# Altium project BMD_RevB_IDL_18_014.PrjPcb (part 2 of 2)

## Sheet BMD_RevB_B6_INOUT.SchDoc: IN/OUT & MISC
size 401 x 291 mm; DocumentNumber: 2; SheetNumber: 6; SheetTotal: 6
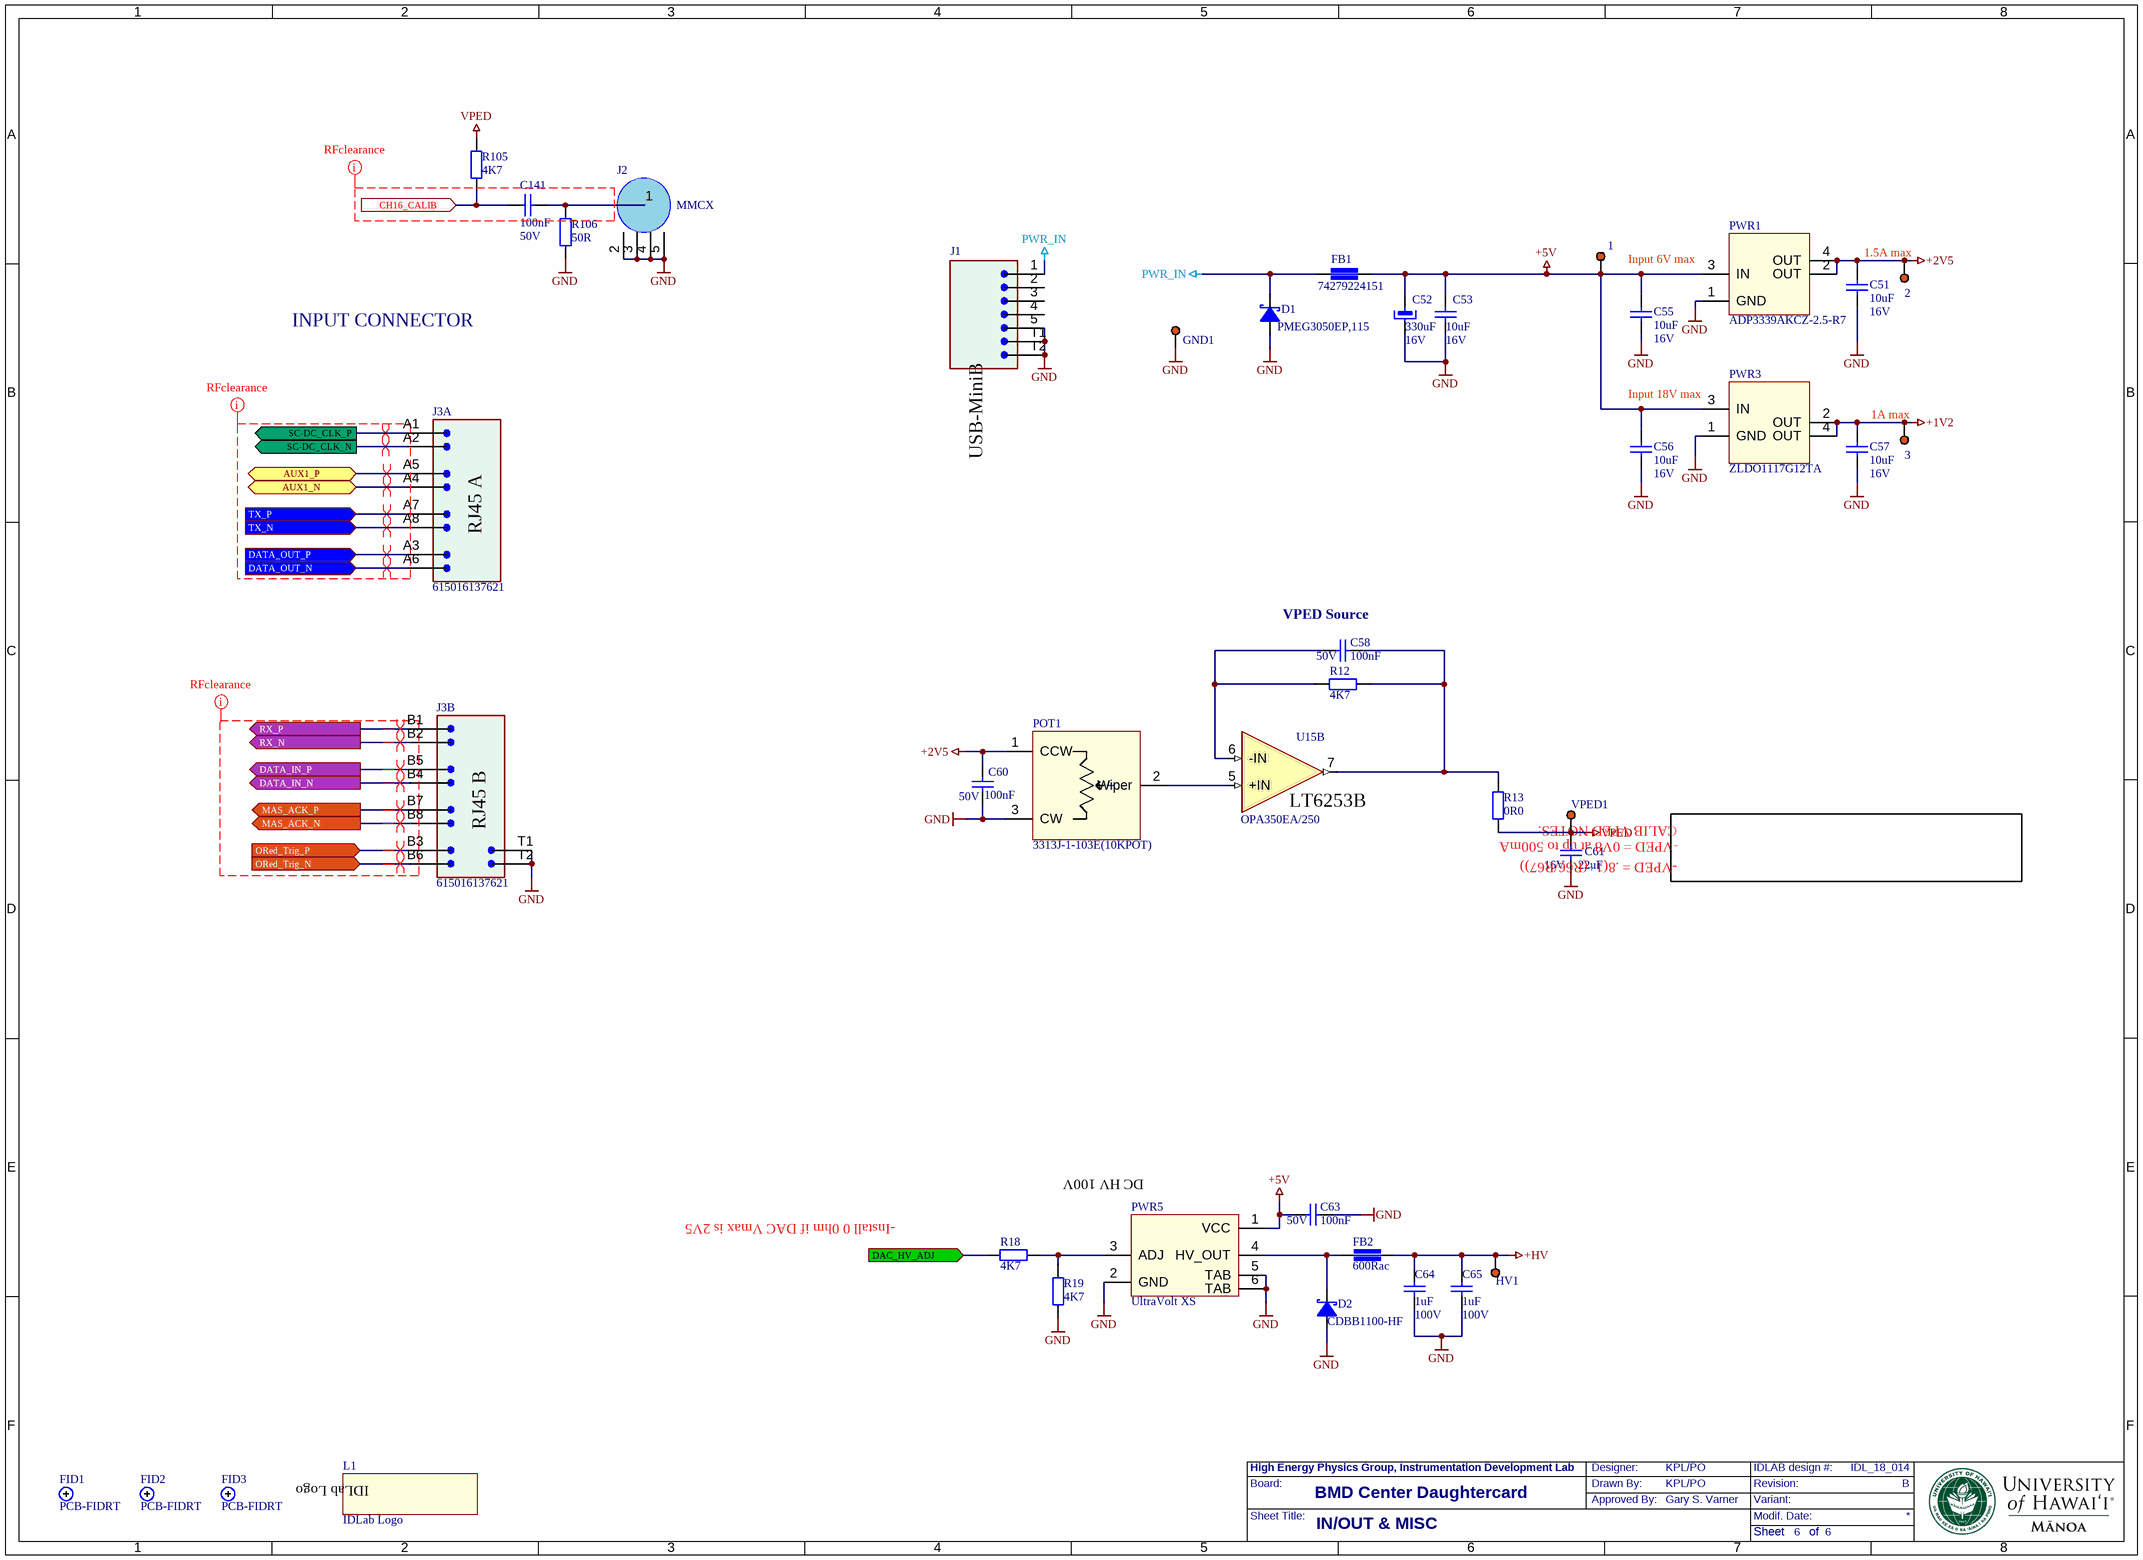
[diagram p5: BMD_RevB_B6_INOUT.SchDoc]

### Parts
(Parts that share a designator on the sheet are numbered #1, #2 ... from top to bottom, then left to right.)
1  SP1.5S  [SP1.5SQ]  (value not drawn)  (no BOM)
2  SP1.5S  [SP1.5SQ]  (value not drawn)  (no BOM)
3  SP1.5S  [SP1.5SQ]  (value not drawn)  (no BOM)
C51  10uF  Voltage rating: 16V  [CC1206N1R]
C52  330uF  Voltage rating: 16V  [CTC-D7343-43]
C53  10uF  Voltage rating: 16V  [CC1206N1R]
C55  10uF  Voltage rating: 16V  [CC1206N1R]
C56  10uF  Voltage rating: 16V  [CC1206N1R]
C57  10uF  Voltage rating: 16V  [CC1206N1R]
C58  100nF  Voltage rating: 50V  [CC0402N1R]
C60  100nF  Voltage rating: 50V  [CC0402N1R]
C61  22uF  Voltage rating: 16V  [CC0805N1R]
C63  100nF  Voltage rating: 50V  [CC0402N1R]
C64  1uF  Voltage rating: 100V  [CC1206N1R]
C65  1uF  Voltage rating: 100V  [CC1206N1R]
C141  100nF  Voltage rating: 50V  [CC0402N1R]
D1  PMEG3050EP,115  [SOD128]
D2  CDBB1100-HF  [DSMB-N]
FB1  74279224151  [FB2220N1R]
FB2  600Rac  [FB0603N1R]
FID1  PCB-FIDRT  [FIDRT50]  (net tie)
FID2  PCB-FIDRT  [FIDRT50]  (net tie)
FID3  PCB-FIDRT  [FIDRT50]  (net tie)
GND1  SP1.5S  [SP1.5SQ]  (value not drawn)  (no BOM)
HV1  SP1.5S  [SP1.5SQ]  (value not drawn)  (no BOM)
J1  0548190519  [USB_MINIB]  (value not drawn)
J2  MMCX  [MMCX_VERTICAL_THROUGH_HOLE]
J3  615016137621  [2X1 RJ45]  (parts A,B of 2)
L1  IDLab Logo  [IDLab logo]
POT1  3313J-1-103E(10KPOT)  [2KPOT]
PWR1  ADP3339AKCZ-2.5-R7  [SOT223]
PWR3  ZLDO1117G12TA  [SOT223]
PWR5  UltraVolt XS  [UltraVolt XS]
R12  4K7  [RC0402N1R]
R13  0R0  [RC0603N1R]
R18  4K7  [RC0402N1R]
R19  4K7  [RC0402N1R]
R105  4K7  [RC0402N1R]
R106  50R  [RC0402RF1]
U15#2  OPA350EA/250  [MSOP8N]  (part B of 2)
VPED1  SP1.5S  [SP1.5SQ]  (value not drawn)  (no BOM)

### Ports
AUX1_N (bidir), AUX1_P (bidir), CH16_CALIB (in), DAC_HV_ADJ (in), DATA_IN_N (out), DATA_IN_P (out), DATA_OUT_N (in), DATA_OUT_P (in), MAS_ACK_N (out), MAS_ACK_P (out), ORed_Trig_N (in), ORed_Trig_P (in), RX_N (out), RX_P (out), SC-DC_CLK_N (out), SC-DC_CLK_P (out), TX_N (in), TX_P (in)

### Nets
+1V2: 3.1 C57.2 PWR3.2(OUT) PWR3.4(OUT)
+2V5: 2.1 C51.2 C60.1 POT1.1(CCW) PWR1.2(OUT) PWR1.4(OUT)
+5V: 1.1 C52.1 C53.2 C55.2 C56.2 C63.2 FB1.2 PWR1.3(IN) PWR3.3(IN) PWR5.1(VCC)
+HV: C64.2 C65.2 FB2.2 HV1.1
GND: C51.1 C52.2 C53.1 C55.1 C56.1 C57.1 C60.2 C61.1 C63.1 C64.1 C65.1 D1.2(A) D2.2(A) GND1.1 J1.5 J1.T1 J1.T2 J2.2 J2.3 J2.4 J2.5 J3.T1 J3.T2 POT1.3(CW) PWR1.1(GND) PWR3.1(GND) PWR5.2(GND) PWR5.5(TAB) PWR5.6(TAB) R19.1 R106.1
PWR_IN: D1.1(C) FB1.1 J1.1
VPED: C61.2 R13.1 R105.2 VPED1.1
AUX1_N: J3.A4 ; port AUX1_N
AUX1_P: J3.A5 ; port AUX1_P
CH16_CALIB: C141.1 R105.1 ; port CH16_CALIB
DAC_HV_ADJ: R18.2 ; port DAC_HV_ADJ
DATA_IN_N: J3.B4 ; port DATA_IN_N
DATA_IN_P: J3.B5 ; port DATA_IN_P
DATA_OUT_N: J3.A6 ; port DATA_OUT_N
DATA_OUT_P: J3.A3 ; port DATA_OUT_P
MAS_ACK_N: J3.B8 ; port MAS_ACK_N
MAS_ACK_P: J3.B7 ; port MAS_ACK_P
ORed_Trig_N: J3.B6 ; port ORed_Trig_N
ORed_Trig_P: J3.B3 ; port ORed_Trig_P
RX_N: J3.B2 ; port RX_N
RX_P: J3.B1 ; port RX_P
SC-DC_CLK_N: J3.A2 ; port SC-DC_CLK_N
SC-DC_CLK_P: J3.A1 ; port SC-DC_CLK_P
TX_N: J3.A8 ; port TX_N
TX_P: J3.A7 ; port TX_P
NetC58_1: C58.1 R12.1 R13.2 U15#2.7(OUT)
NetC58_2: C58.2 R12.2 U15#2.6(-IN)
NetC141_2: C141.2 J2.1 R106.2
NetD2_1: D2.1(C) FB2.1 PWR5.4(HV_OUT)
NetPOT1_2: POT1.2(Wiper) U15#2.5(+IN)
NetPWR5_3: PWR5.3(ADJ) R18.1 R19.2

Not connected (* = marked no-connect by the designer): J1 2 3 4

### Layout directives
net class RF: (no net found under the mark)
differential pair: AUX1_N, AUX1_P, DATA_IN_N, DATA_IN_P, DATA_OUT_N, DATA_OUT_P, MAS_ACK_N, MAS_ACK_P, ORed_Trig_N, ORed_Trig_P, RX_N, RX_P, SC-DC_CLK_N, SC-DC_CLK_P, TX_N, TX_P

### Notes on the sheet
- Input 6V max
- 1.5A max
- INPUT CONNECTOR
- (near PWR3) Input 18V max
- (near 3) 1A max
- (near C58) VPED Source
- CALIB VPED NOTES:
- -VPED = .8(1+(R66/R67))
- -VPED = 0V8 at up to 500mA
- (near PWR5) -Install 0 0hm if DAC Vmax is 2V5
- (near PWR5) DC HV 100V
- Board:
- High Energy Physics Group, Instrumentation Development Lab
- Drawn By:
- Designer:
- Approved By:
- Revision:
- IDLAB design #:
- Variant:
- Sheet Title:
- Modif. Date:
- Sheet       of
- (in symbol 2x1 RJ45 CONN, part A) RJ45 A
- (in symbol 2x1 RJ45 CONN, part B) RJ45 B
- (in symbol OPAMP_LT6253CMS8, part B) LT6253B
- (in symbol USB Mini B CONN) USB-MiniB

### Library data of the parts
1-3 GND1 HV1 VPED1 = SP1.5S: Wire solder pin 1.5mm; Sort: 610; Tech: THDW; Price: 0
C51 C53 C55-C57 = CAPCC1206_10U_16VX7R: 10µF 16V Ceramic Capacitor X7R 1206; Manufacturer: TDK; Manufacturer No: C3216X7R1C106M160AC; Tech: SMDR; Package: Cap Chip 1206; Supplier 1: Digi-Key; Supplier Part Number 1: 445-1601-1-ND
C52 = CAPT7343_330U_16V: 330µF Molded Tantalum - Polymer Capacitors 16V; Manufacturer: Kemet; Manufacturer No: T521X337M016ATE050; Tech: SMDR; Package: Tant SMD D 7343-43; Supplier 1: Digi-Key; Supplier Part Number 1: 399-10365-6-ND
C58 C60 C63 C141 = CAPCC0402_100N_50VX7R: 0.10µF 50V Ceramic Capacitor X7R 0402; Manufacturer: TDK; Manufacturer No: C1005X7R1H104K050BB; Tech: SMDR; Package: Cap Chip 0402; Supplier 1: Digi-Key; Supplier Part Number 1: 445-5932-1-ND
C61 = CAPCC0805_22U_16VX7R: 22µF 16V Ceramic Capacitor X5R 0805; Manufacturer: Murata; Manufacturer No: GRM219R61C226ME15L; Tech: SMDR; Package: Cap Chip 0805; Supplier 1: Digi-Key; Supplier Part Number 1: 490-9952-1-ND
C64 C65 = CAPCC1206_1U_100VX7R: Capacitor chip ceramic 1206 100V X7R; Manufacturer: TDK; Manufacturer No: C3216X7R2A105K160AA; Tech: SMDR; Package: Cap Chip 1206; Supplier 1: Digi-Key; Supplier Part Number 1: 445-4467-1-ND; Supplier 2: Mouser; Supplier Part Number 2: 810-C3216X7R2A105K
D1 = Schottky_Diodes_5A_30V: DIODE SCHOTTKY 30V 5A SOD128  500ns 0.36Vf; Manufacturer: NXP; Tech: SMDR; Package: SMB; Manufacturer No: PMEG3050EP,115; Supplier 1: Digi-Key; Supplier Part Number 1: 568-6753-6-ND
D2 = Schottky_Diode_1A_100V: Schottky diode 1A 100V; Manufacturer: Comchip Technology; Tech: SMDR; Package: SMB; Manufacturer No: CDBB1100-HF; Supplier 1: Digi-Key; Supplier Part Number 1: 641-1709-1-ND
FB1 = FB2220-74279224151: Feritte filter smd 2220 5A 10mRdc 150Rac; Manufacturer: Wurth; Tech: SMDR; Manufacturer No: 74279224151; Package: Filter Chip 2220; Supplier 1: Digi-Key; Supplier Part Number 1: 732-3423-1-ND; Supplier 2: Mouser; Supplier Part Number 2: 710-74279224151
FB2 = FB0603-600R_0.2A: Feritte filter smd 0603 0.2A 1Rdc; Manufacturer: Murata; Manufacturer No: BLM18HG601SN1; Tech: SMDR; Package: Filter Chip 0603; Supplier 1: Digi-Key; Supplier Part Number 1: 490-1033-6-ND; Supplier 2: Newark; Supplier Part Number 2: 73M9104; Supplier 3: Mouser; Supplier Part Number 3: 81-BLM11HA601SG
FID1-FID3 = PCB-FIDRT: Fiducial top round open mask; Sort: 800; Tech: MECH; Price: 0
J1 = USB Mini B CONN: CONN USB RECEPTACLE 5POS RT ANG; Manufacturer: Molex, LLC; Tech: Through Hole, Right Angle; Manufacturer No: 0548190519; Package: USB - mini B; Supplier 1: Digi-Key; Supplier Part Number 1: WM17115-ND
J2 = MMCX: CONN MMCX JACK STR 50 OHM PCB; Manufacturer: Molex, LLC; Manufacturer part #: 0734151471; Cost: $3.10; Package size: MMCX; Supplier 1: Digi-Key; Supplier Part Number 1: WM5557-ND
J3 = 2x1 RJ45 CONN: CONN MOD JACK 8P8C R/A SHIELDED; Manufacturer: Wurth Electronics Inc.; Tech: Through Hole, Right Angle; Manufacturer No: 615016137621; Package: RJ45, Ethernet; Supplier 1: Digi-Key; Supplier Part Number 1: 732-2744-ND
POT1 = 3313J-1-103E(10KPOT): TRIMMER 10K OHM 0.125W SMD; Manufacturer: Bourns Inc.; cost: $2.08; Manufacturer part #: 3313J-1-103E; Package size: Rectangular - 0.138" x 0.126" Face x 0.087" H (3.50mm x 3.20mm x 2.20mm); Supplier 1: Digi-Key; Supplier Part Number 1: 3313J-103ECT-ND
PWR1 = 2V5 REG LDO: IC REG LDO 2.5V 1.5A SOT223-3; Manufacturer: Analog Devices Inc.; Tech: Surface Mount; Manufacturer No: ADP3339AKCZ-2.5-R7; Package: SOT-223-3/ ADP3339; Supplier 1: Digi-Key; Supplier Part Number 1: ADP3339AKCZ-2.5-R7CT-ND
PWR3 = 1V2 REG LDO: IC REG LDO 1.2V 1A SOT223-3; Manufacturer: Diodes Incorporated; Tech: Surface Mount; Manufacturer No: ZLDO1117G12TA; Supplier 1: Digi-Key; Supplier Part Number 1: ZLDO1117G12DICT-ND
PWR5 = UltraVolt_XS: DC-DC high-voltage power supply 100V; Manufacturer: Adavance Energy; Tech: Through hole; Manufacturer No: UltraVolt XS
R12 R18 R19 R105 = RES0402-4.7K-1%100PPM: RES SMD 4.7K OHM 1% 1/10W 0402; Manufacturer: Panasonic; Manufacturer No: ERJ-2RKF4701X; Tech: SMDR; Package: Res Chip 0402; Supplier 1: Digi-Key; Supplier Part Number 1: P4.70KLCT-ND
R13 = RES0603-0R0-1%100PPM: RES SMD 0.0OHM JUMPER 1/10W 0603; Manufacturer: Panasonic; Manufacturer No: ERJ-3GEY0R00V; Tech: SMDR; Package: Res Chip 0603; Supplier 1: Digi-Key; Supplier Part Number 1: P0.0GCT-ND
R106 = RES0402-50R-1%100PPM: RES SMD 49.9 OHM 1% 1/16W 0402; Manufacturer: Samsung Inc.; Manufacturer No: RC1005F49R9CS; Tech: SMDR; Package: Res Chip 0402; Supplier 1: Digi-Key; Supplier Part Number 1: 1276-3469-1-ND
U15#2 = OPAMP_LT6253CMS8: Single-Supply, Rail-to-Rail, 720MHZ; Manufacturer: Linear Technology/Analog Devices; Manufacturer No: LTC6253CMS8#PBF; Tech: SMDR; Package: MSOP8; Supplier 1: Digi-Key; Supplier Part Number 1: LTC6253CMS8#PBF-ND

## Nets that join several sheets
+1V2: BMD_RevB_B3_FPGA (11 pins), BMD_RevB_B6_INOUT (3.1 C57.2 PWR3.2 PWR3.4)
+2V5: BMD_RevB_B2_TX (30 pins), BMD_RevB_B3_FPGA (39 pins), BMD_RevB_B4_FPGA2 (16 pins), BMD_RevB_B5_AMP (16 pins), BMD_RevB_B6_INOUT (6 pins)
+5V: BMD_RevB_B3_FPGA (R8.1), BMD_RevB_B4_FPGA2 (6 pins), BMD_RevB_B6_INOUT (10 pins)
+HV: BMD_RevB_B5_AMP (15 pins), BMD_RevB_B6_INOUT (C64.2 C65.2 FB2.2 HV1.1)
GND: BMD_RevB_B2_TX (55 pins), BMD_RevB_B3_FPGA (41 pins), BMD_RevB_B4_FPGA2 (19 pins), BMD_RevB_B5_AMP (46 pins), BMD_RevB_B6_INOUT (31 pins)
VPED: BMD_RevB_B5_AMP (45 pins), BMD_RevB_B6_INOUT (C61.2 R13.1 R105.2 VPED1.1)
AUX1_N: BMD_RevB_B3_FPGA (U2.133), BMD_RevB_B6_INOUT (J3.A4)
AUX1_P: BMD_RevB_B3_FPGA (U2.134), BMD_RevB_B6_INOUT (J3.A5)
CH1_DACbuf: BMD_RevB_B4_FPGA2 (U5.1), BMD_RevB_B5_AMP (C86.1 R42.1)
CH1_TGXin: BMD_RevB_B2_TX (U1.1), BMD_RevB_B5_AMP (C73.2 R30.2 R107.2 U8.1)
CH2_DACbuf: BMD_RevB_B4_FPGA2 (U5.2), BMD_RevB_B5_AMP (C105.1 R64.1)
CH2_TGXin: BMD_RevB_B2_TX (U1.3), BMD_RevB_B5_AMP (C94.2 R55.2 R113.2 U8.7)
CH3_DACbuf: BMD_RevB_B4_FPGA2 (U5.9), BMD_RevB_B5_AMP (C124.1 R84.1)
CH3_TGXin: BMD_RevB_B2_TX (U1.5), BMD_RevB_B5_AMP (C110.2 R72.2 R117.2 U9.1)
CH4_DACbuf: BMD_RevB_B4_FPGA2 (U5.10), BMD_RevB_B5_AMP (C140.1 R104.1)
CH4_TGXin: BMD_RevB_B2_TX (U1.7), BMD_RevB_B5_AMP (C130.2 R97.2 R121.2 U9.7)
CH5_DACbuf: BMD_RevB_B4_FPGA2 (U5.20), BMD_RevB_B5_AMP (C87.1 R43.1)
CH5_TGXin: BMD_RevB_B2_TX (U1.9), BMD_RevB_B5_AMP (C74.2 R31.2 R108.2 U10.1)
CH6_DACbuf: BMD_RevB_B4_FPGA2 (U5.19), BMD_RevB_B5_AMP (C103.1 R62.1)
CH6_TGXin: BMD_RevB_B2_TX (U1.11), BMD_RevB_B5_AMP (C92.2 R51.2 R111.2 U10.7)
CH7_DACbuf: BMD_RevB_B4_FPGA2 (U5.12), BMD_RevB_B5_AMP (C122.1 R82.1)
CH7_TGXin: BMD_RevB_B2_TX (U1.13), BMD_RevB_B5_AMP (C108.2 R70.2 R115.2 U11.1)
CH8_DACbuf: BMD_RevB_B4_FPGA2 (U5.11), BMD_RevB_B5_AMP (C138.1 R102.1)
CH8_TGXin: BMD_RevB_B2_TX (U1.15), BMD_RevB_B5_AMP (C128.2 R91.2 R120.2 U11.7)
CH9_DACbuf: BMD_RevB_B4_FPGA2 (U7.9), BMD_RevB_B5_AMP (C88.1 R44.1)
CH9_TGXin: BMD_RevB_B2_TX (U1.17), BMD_RevB_B5_AMP (C75.2 R32.2 R109.2 U12.1)
CH10_DACbuf: BMD_RevB_B4_FPGA2 (U7.10), BMD_RevB_B5_AMP (C104.1 R63.1)
CH10_TGXin: BMD_RevB_B2_TX (U1.19), BMD_RevB_B5_AMP (C93.2 R53.2 R112.2 U12.7)
CH11_DACbuf: BMD_RevB_B4_FPGA2 (U7.2), BMD_RevB_B5_AMP (C123.1 R83.1)
CH11_TGXin: BMD_RevB_B2_TX (U1.21), BMD_RevB_B5_AMP (C109.2 R71.2 R116.2 U13.1)
CH12_DACbuf: BMD_RevB_B4_FPGA2 (U7.1), BMD_RevB_B5_AMP (C139.1 R103.1)
CH12_TGXin: BMD_RevB_B2_TX (U1.23), BMD_RevB_B5_AMP (C129.2 R93.2 R119.2 U13.7)
CH13_DACbuf: BMD_RevB_B4_FPGA2 (U7.12), BMD_RevB_B5_AMP (C95.1 R49.1)
CH13_TGXin: BMD_RevB_B2_TX (U1.25), BMD_RevB_B5_AMP (C85.2 R45.2 R110.2 U14.1)
CH14_DACbuf: BMD_RevB_B4_FPGA2 (U7.11), BMD_RevB_B5_AMP (C111.1 R69.1)
CH14_TGXin: BMD_RevB_B2_TX (U1.27), BMD_RevB_B5_AMP (C102.2 R66.2 R114.2 U14.7)
CH15_DACbuf: BMD_RevB_B4_FPGA2 (U7.19), BMD_RevB_B5_AMP (C131.1 R89.1)
CH15_TGXin: BMD_RevB_B2_TX (U1.29), BMD_RevB_B5_AMP (C121.2 R85.2 R118.2 U15#1.1)
CH16_CALIB: BMD_RevB_B2_TX (U1.31), BMD_RevB_B6_INOUT (C141.1 R105.1)
CLR: BMD_RevB_B2_TX (U1.95), BMD_RevB_B3_FPGA (U2.78)
DAC_HV_ADJ: BMD_RevB_B4_FPGA2 (U6.1 U6.4), BMD_RevB_B6_INOUT (R18.2)
DAC_~{LDAC}: BMD_RevB_B3_FPGA (U2.50), BMD_RevB_B4_FPGA2 (U5.15 U7.15)
DAC_~{SYNC}: BMD_RevB_B3_FPGA (U2.48), BMD_RevB_B4_FPGA2 (U5.5 U7.5)
DAC_SCLK: BMD_RevB_B3_FPGA (U2.47), BMD_RevB_B4_FPGA2 (U5.6 U7.6)
DAC_SDI: BMD_RevB_B3_FPGA (U2.46), BMD_RevB_B4_FPGA2 (U5.7)
DAC_SDO: BMD_RevB_B3_FPGA (U2.51), BMD_RevB_B4_FPGA2 (U7.16)
DATA_IN_N: BMD_RevB_B3_FPGA (R123.1 U2.123), BMD_RevB_B6_INOUT (J3.B4)
DATA_IN_P: BMD_RevB_B3_FPGA (R123.2 U2.124), BMD_RevB_B6_INOUT (J3.B5)
DATA_OUT_N: BMD_RevB_B3_FPGA (U2.137), BMD_RevB_B6_INOUT (J3.A6)
DATA_OUT_P: BMD_RevB_B3_FPGA (U2.138), BMD_RevB_B6_INOUT (J3.A3)
DO_1: BMD_RevB_B2_TX (U1.91), BMD_RevB_B3_FPGA (U2.80)
DO_2: BMD_RevB_B2_TX (U1.90), BMD_RevB_B3_FPGA (U2.81)
DO_3: BMD_RevB_B2_TX (U1.89), BMD_RevB_B3_FPGA (U2.82)
DO_4: BMD_RevB_B2_TX (U1.88), BMD_RevB_B3_FPGA (U2.83)
DO_5: BMD_RevB_B2_TX (U1.87), BMD_RevB_B3_FPGA (U2.84)
DO_6: BMD_RevB_B2_TX (U1.86), BMD_RevB_B3_FPGA (U2.85)
DO_7: BMD_RevB_B2_TX (U1.85), BMD_RevB_B3_FPGA (U2.87)
DO_8: BMD_RevB_B2_TX (U1.84), BMD_RevB_B3_FPGA (U2.88)
DO_9: BMD_RevB_B2_TX (U1.76), BMD_RevB_B3_FPGA (U2.95)
DO_10: BMD_RevB_B2_TX (U1.75), BMD_RevB_B3_FPGA (U2.97)
DO_11: BMD_RevB_B2_TX (U1.74), BMD_RevB_B3_FPGA (U2.98)
DO_12: BMD_RevB_B2_TX (U1.73), BMD_RevB_B3_FPGA (U2.99)
DO_13: BMD_RevB_B2_TX (U1.72), BMD_RevB_B3_FPGA (U2.100)
DO_14: BMD_RevB_B2_TX (U1.71), BMD_RevB_B3_FPGA (U2.101)
DO_15: BMD_RevB_B2_TX (U1.70), BMD_RevB_B3_FPGA (U2.102)
DO_16: BMD_RevB_B2_TX (U1.69), BMD_RevB_B3_FPGA (U2.104)
Done: BMD_RevB_B2_TX (U1.94), BMD_RevB_B3_FPGA (U2.79)
FLASH_~{CS}: BMD_RevB_B3_FPGA (U2.38), BMD_RevB_B4_FPGA2 (R25.1 U4.1)
FLASH_CLK: BMD_RevB_B3_FPGA (U2.70), BMD_RevB_B4_FPGA2 (U4.6)
FLASH_DI: BMD_RevB_B3_FPGA (U2.64), BMD_RevB_B4_FPGA2 (U4.5)
FLASH_DO: BMD_RevB_B3_FPGA (U2.65), BMD_RevB_B4_FPGA2 (U4.2)
MAS_ACK_N: BMD_RevB_B3_FPGA (R124.1 U2.1), BMD_RevB_B6_INOUT (J3.B8)
MAS_ACK_P: BMD_RevB_B3_FPGA (R124.2 U2.2), BMD_RevB_B6_INOUT (J3.B7)
MON_Timing: BMD_RevB_B2_TX (U1.116), BMD_RevB_B3_FPGA (U2.32)
ORed_Trig_N: BMD_RevB_B3_FPGA (U2.141), BMD_RevB_B6_INOUT (J3.B6)
ORed_Trig_P: BMD_RevB_B3_FPGA (U2.142), BMD_RevB_B6_INOUT (J3.B3)
PCLK: BMD_RevB_B2_TX (U1.37), BMD_RevB_B3_FPGA (U2.6)
Ramp: BMD_RevB_B2_TX (U1.108), BMD_RevB_B3_FPGA (U2.58)
RD_CS_S0: BMD_RevB_B2_TX (U1.46), BMD_RevB_B3_FPGA (U2.14)
RD_CS_S1: BMD_RevB_B2_TX (U1.47), BMD_RevB_B3_FPGA (U2.15)
RD_CS_S2: BMD_RevB_B2_TX (U1.48), BMD_RevB_B3_FPGA (U2.16)
RD_CS_S3: BMD_RevB_B2_TX (U1.49), BMD_RevB_B3_FPGA (U2.17)
RD_CS_S4: BMD_RevB_B2_TX (U1.50), BMD_RevB_B3_FPGA (U2.21)
RD_CS_S5: BMD_RevB_B2_TX (U1.51), BMD_RevB_B3_FPGA (U2.22)
RD_ENA: BMD_RevB_B2_TX (U1.100), BMD_RevB_B3_FPGA (U2.66)
RD_RS_S0: BMD_RevB_B2_TX (U1.105), BMD_RevB_B3_FPGA (U2.59)
RD_RS_S1: BMD_RevB_B2_TX (U1.104), BMD_RevB_B3_FPGA (U2.61)
RD_RS_S2: BMD_RevB_B2_TX (U1.103), BMD_RevB_B3_FPGA (U2.62)
RegCLR: BMD_RevB_B2_TX (U1.99), BMD_RevB_B3_FPGA (U2.67)
RX_N: BMD_RevB_B3_FPGA (R122.1 U2.126), BMD_RevB_B6_INOUT (J3.B2)
RX_P: BMD_RevB_B3_FPGA (R122.2 U2.127), BMD_RevB_B6_INOUT (J3.B1)
SC-DC_CLK_N: BMD_RevB_B3_FPGA (R4.1 U2.131), BMD_RevB_B6_INOUT (J3.A2)
SC-DC_CLK_P: BMD_RevB_B3_FPGA (R4.2 U2.132), BMD_RevB_B6_INOUT (J3.A1)
SCLK: BMD_RevB_B2_TX (U1.36), BMD_RevB_B3_FPGA (U2.5)
SHout: BMD_RevB_B2_TX (U1.38), BMD_RevB_B3_FPGA (U2.7)
SIN: BMD_RevB_B2_TX (U1.35), BMD_RevB_B3_FPGA (U2.143)
SmplSel_S1: BMD_RevB_B2_TX (U1.65), BMD_RevB_B3_FPGA (U2.111)
SmplSel_S2: BMD_RevB_B2_TX (U1.64), BMD_RevB_B3_FPGA (U2.112)
SmplSel_S3: BMD_RevB_B2_TX (U1.63), BMD_RevB_B3_FPGA (U2.114)
SmplSel_S4: BMD_RevB_B2_TX (U1.62), BMD_RevB_B3_FPGA (U2.115)
SmplSel_S5: BMD_RevB_B2_TX (U1.61), BMD_RevB_B3_FPGA (U2.116)
SmplSI_Any: BMD_RevB_B2_TX (U1.66), BMD_RevB_B3_FPGA (U2.105)
SR_Clear: BMD_RevB_B2_TX (U1.79), BMD_RevB_B3_FPGA (U2.94)
SR_Clock: BMD_RevB_B2_TX (U1.80), BMD_RevB_B3_FPGA (U2.93)
SR_SEL: BMD_RevB_B2_TX (U1.81), BMD_RevB_B3_FPGA (U2.92)
SSTin_N: BMD_RevB_B2_TX (R2.1 U1.126), BMD_RevB_B3_FPGA (U2.43)
SSTin_P: BMD_RevB_B2_TX (R2.2 U1.125), BMD_RevB_B3_FPGA (U2.44)
TCK: BMD_RevB_B3_FPGA (U2.109), BMD_RevB_B4_FPGA2 (JTAG1.6 R22.1)
TDI: BMD_RevB_B3_FPGA (U2.110), BMD_RevB_B4_FPGA2 (JTAG1.10 R24.1)
TDO: BMD_RevB_B3_FPGA (U2.106), BMD_RevB_B4_FPGA2 (JTAG1.8 R23.1)
TMS: BMD_RevB_B3_FPGA (U2.107), BMD_RevB_B4_FPGA2 (JTAG1.4 R21.1)
TRG_1: BMD_RevB_B2_TX (U1.119), BMD_RevB_B3_FPGA (U2.34)
TRG_2: BMD_RevB_B2_TX (U1.118), BMD_RevB_B3_FPGA (U2.33)
TRG_3: BMD_RevB_B2_TX (U1.41), BMD_RevB_B3_FPGA (U2.8)
TRG_4: BMD_RevB_B2_TX (U1.42), BMD_RevB_B3_FPGA (U2.9)
TRG_5: BMD_RevB_B2_TX (U1.43), BMD_RevB_B3_FPGA (U2.10)
TX_N: BMD_RevB_B3_FPGA (U2.139), BMD_RevB_B6_INOUT (J3.A8)
TX_P: BMD_RevB_B3_FPGA (U2.140), BMD_RevB_B6_INOUT (J3.A7)
WL_CLK_N: BMD_RevB_B2_TX (R1.1 U1.57), BMD_RevB_B3_FPGA (U2.120)
WL_CLK_P: BMD_RevB_B2_TX (R1.2 U1.58), BMD_RevB_B3_FPGA (U2.121)
WR1_Ena: BMD_RevB_B2_TX (U1.55), BMD_RevB_B3_FPGA (U2.56)
WR2_Ena: BMD_RevB_B2_TX (U1.56), BMD_RevB_B3_FPGA (U2.119)
WR_AddrClr: BMD_RevB_B2_TX (U1.54), BMD_RevB_B3_FPGA (U2.55)

## Assembly variants
Single-Ended Input: not fitted C2 C4 C9 C10 C19 C20 C22 C24 C29 C30 C39 C40 C42 C45 C50 C52 C54 C59 C60 C69 C70 C72 C74 C79 C80 C89 C90 C92 C95 C100 C102 C104 C109 C110 C119 C120 C122 C124 C129 C130 C139 C140 C142 C145 C150 HS1 R3 R5 R7 R23 R25 R39 R50 R52 R68 R70 R84 R95 R97 R113 R115 R129 R164 R165 R166 R167 R168 R169 R170 R171 R172 R173 R174 R175 R176 R177 R178 TIP1
Differential Input: not fitted C2 C4 C19 C20 C22 C24 C39 C40 C42 C50 C52 C54 C69 C70 C72 C74 C89 C90 C92 C100 C102 C104 C119 C120 C122 C124 C139 C140 C142 C150 HS1 R4 R5 R7 R13 R14 R21 R22 R23 R25 R31 R32 R38 R39 R48 R49 R50 R52 R58 R59 R66 R67 R68 R70 R76 R77 R83 R84 R88 R93 R94 R95 R97 R103 R104 R111 R112 R113 R115 R121 R122 R128 R129 R133 R164 R333 TIP1